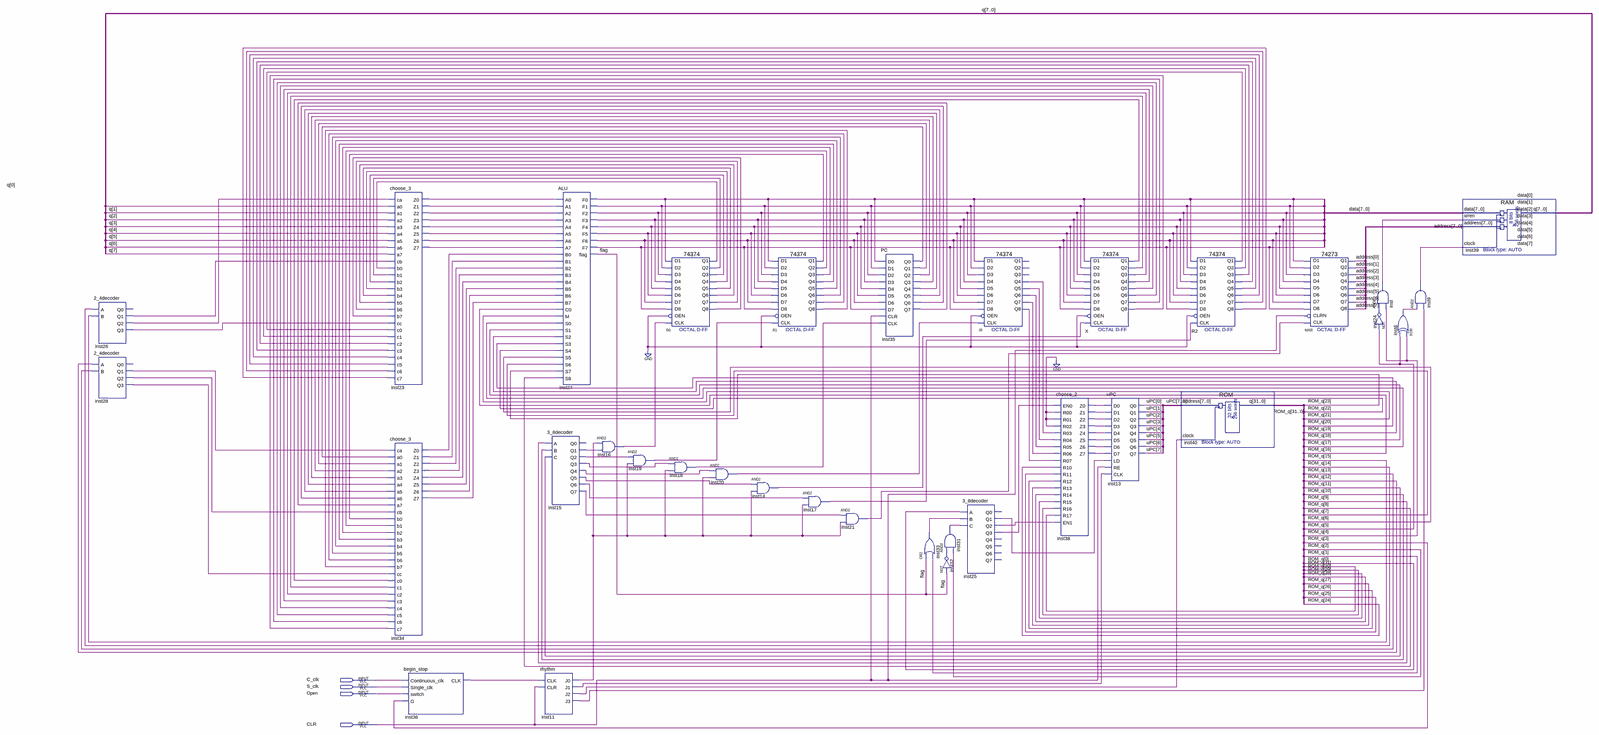
[diagram p0: schematic sheet, whole]
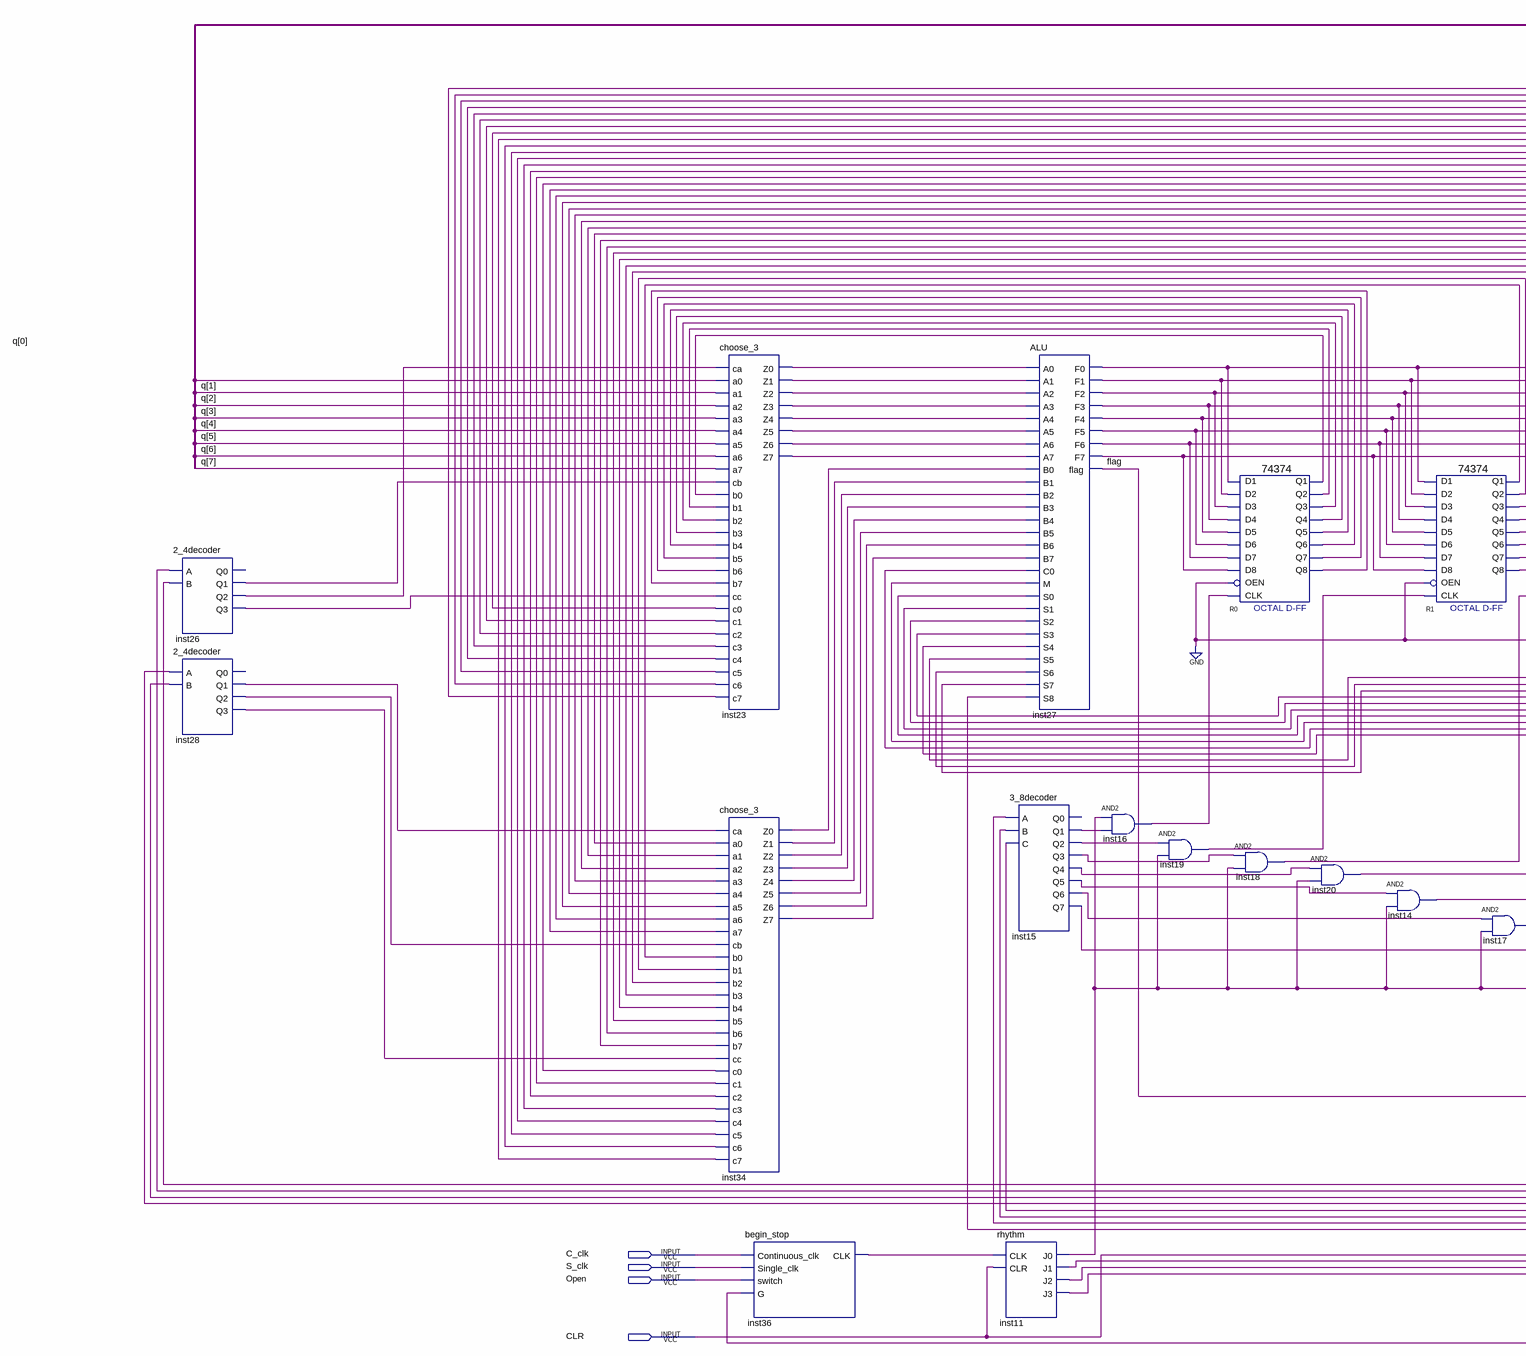
[diagram p1: schematic sheet, left part]
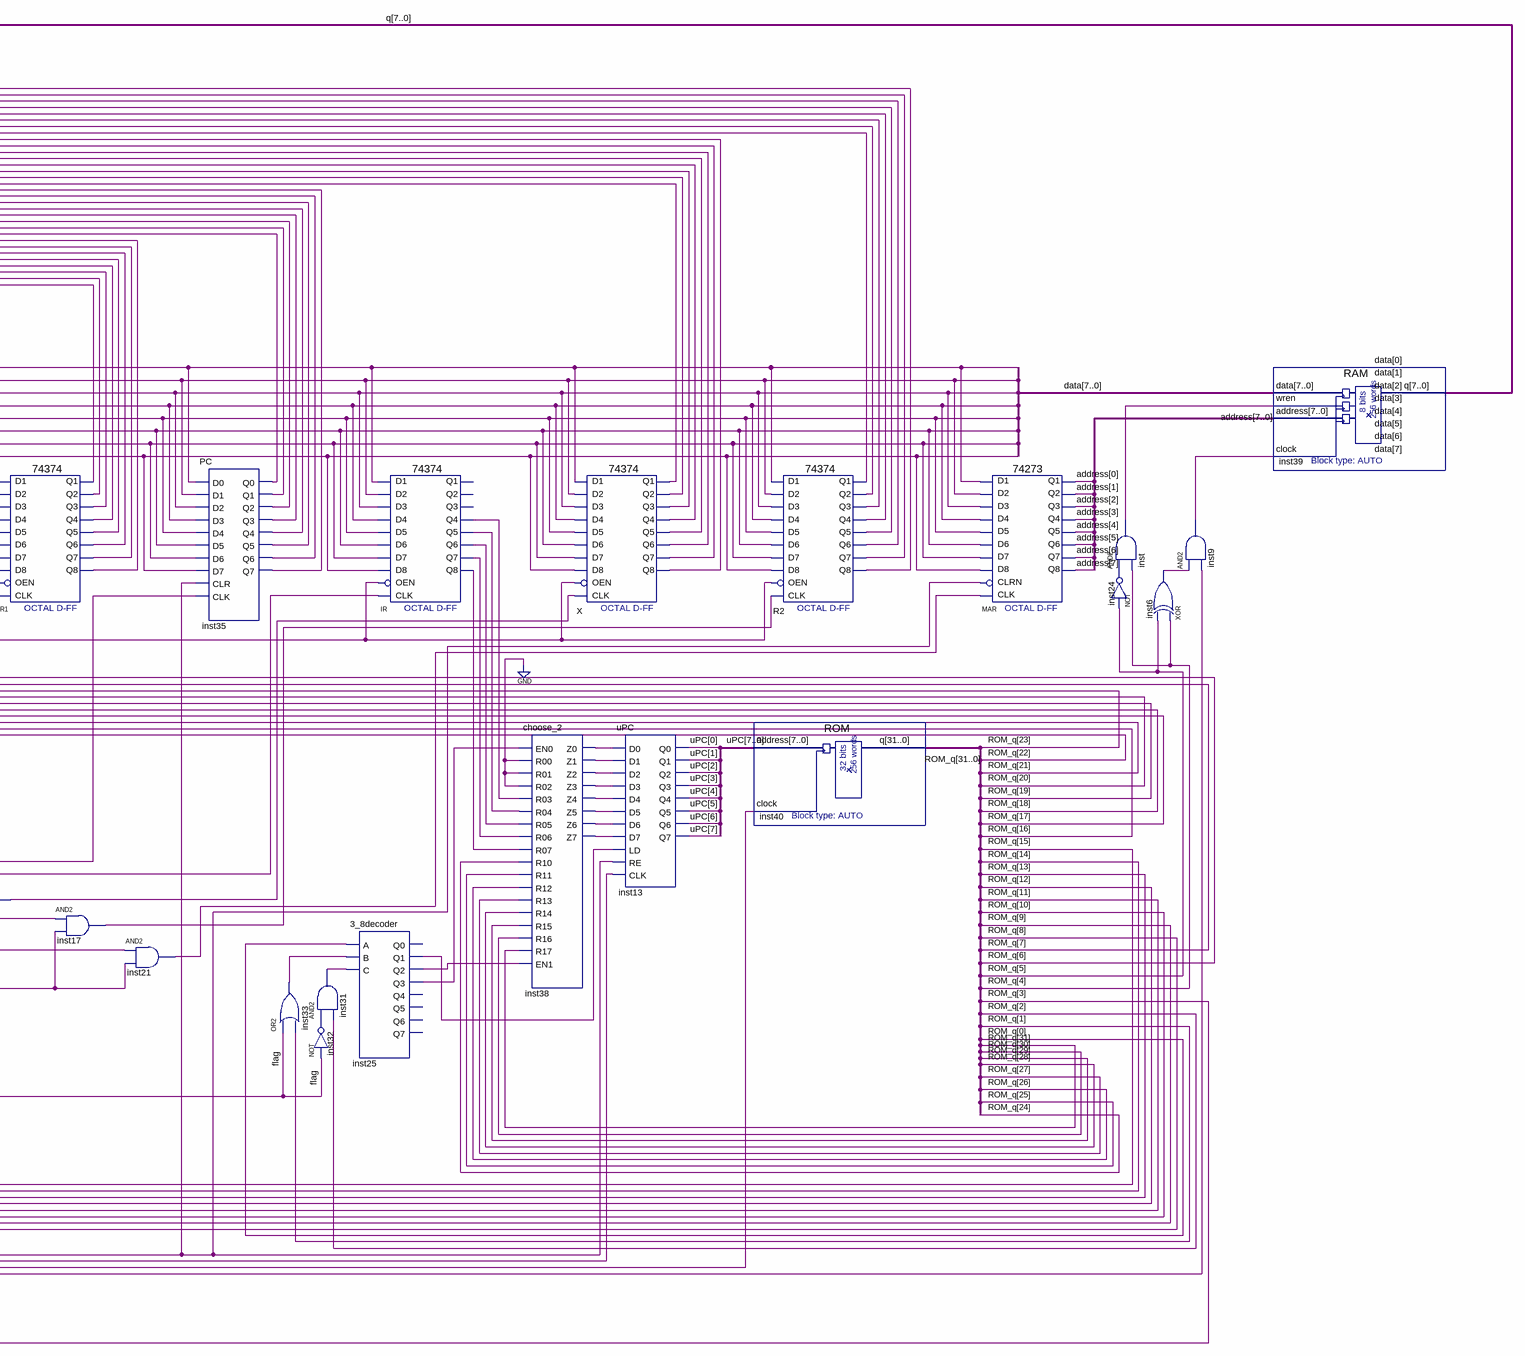
[diagram p2: schematic sheet, right part]
// Quartus schematic ex3.bdf as structural Verilog: 34 symbols, 4 pins
module ex3 (
  input  C_clk,
  input  S_clk,
  input  Open,
  input  CLR
);

  wire flag, inst6_out, inst9_out, inst11_j0, inst11_j1, inst11_j2, inst11_j3, inst14_out, inst15_q1,
       inst15_q2, inst15_q3, inst15_q4, inst15_q5, inst15_q6, inst15_q7, inst16_out, inst17_out, inst18_out,
       inst19_out, inst20_out, inst21_out, inst23_z0, inst23_z1, inst23_z2, inst23_z3, inst23_z4, inst23_z5,
       inst23_z6, inst23_z7, inst24_out, inst25_q1, inst25_q2, inst25_q3, inst26_q1, inst26_q2, inst26_q3,
       inst28_q1, inst28_q2, inst28_q3, inst31_out, inst32_out, inst33_out, inst34_z0, inst34_z1, inst34_z2,
       inst34_z3, inst34_z4, inst34_z5, inst34_z6, inst34_z7, inst35_q0, inst35_q1, inst35_q2, inst35_q3,
       inst35_q4, inst35_q5, inst35_q6, inst35_q7, inst36_clk, inst38_z0, inst38_z1, inst38_z2, inst38_z3,
       inst38_z4, inst38_z5, inst38_z6, inst38_z7, inst_out, IR_q4, IR_q5, IR_q6, IR_q7, IR_q8, R0_q1, R0_q2,
       R0_q3, R0_q4, R0_q5, R0_q6, R0_q7, R0_q8, R1_q1, R1_q2, R1_q3, R1_q4, R1_q5, R1_q6, R1_q7, R1_q8,
       R2_q1, R2_q2, R2_q3, R2_q4, R2_q5, R2_q6, R2_q7, R2_q8, X_q1, X_q2, X_q3, X_q4, X_q5, X_q6, X_q7, X_q8;
  wire [7:0] address, data, q, uPC;
  wire [31:0] ROM_q;

  \2_4decoder  inst26 (.A(ROM_q[14]), .B(ROM_q[15]), .Q1(inst26_q1), .Q2(inst26_q2), .Q3(inst26_q3));  // open: Q0
  \2_4decoder  inst28 (.A(ROM_q[12]), .B(ROM_q[13]), .Q1(inst28_q1), .Q2(inst28_q2), .Q3(inst28_q3));  // open: Q0
  choose_3 inst23 (
    .ca(inst26_q2), .a0(q[0]), .a1(q[1]), .a2(q[2]), .a3(q[3]), .a4(q[4]), .a5(q[5]), .a6(q[6]), .a7(q[7]),
    .cb(inst26_q1), .b0(R0_q1), .b1(R0_q2), .b2(R0_q3), .b3(R0_q4), .b4(R0_q5), .b5(R0_q6), .b6(R0_q7),
    .b7(R0_q8), .cc(inst26_q3), .c0(R2_q1), .c1(R2_q2), .c2(R2_q3), .c3(R2_q4), .c4(R2_q5), .c5(R2_q6),
    .c6(R2_q7), .c7(R2_q8), .Z0(inst23_z0), .Z1(inst23_z1), .Z2(inst23_z2), .Z3(inst23_z3), .Z4(inst23_z4),
    .Z5(inst23_z5), .Z6(inst23_z6), .Z7(inst23_z7));
  choose_3 inst34 (
    .ca(inst28_q1), .a0(inst35_q0), .a1(inst35_q1), .a2(inst35_q2), .a3(inst35_q3), .a4(inst35_q4),
    .a5(inst35_q5), .a6(inst35_q6), .a7(inst35_q7), .cb(inst28_q2), .b0(R1_q1), .b1(R1_q2), .b2(R1_q3),
    .b3(R1_q4), .b4(R1_q5), .b5(R1_q6), .b6(R1_q7), .b7(R1_q8), .cc(inst28_q3), .c0(X_q1), .c1(X_q2),
    .c2(X_q3), .c3(X_q4), .c4(X_q5), .c5(X_q6), .c6(X_q7), .c7(X_q8), .Z0(inst34_z0), .Z1(inst34_z1),
    .Z2(inst34_z2), .Z3(inst34_z3), .Z4(inst34_z4), .Z5(inst34_z5), .Z6(inst34_z6), .Z7(inst34_z7));
  begin_stop inst36 (.Continuous_clk(C_clk), .Single_clk(S_clk), .switch(Open), .G(ROM_q[3]), .CLK(inst36_clk));
  \3_8decoder  inst15 (
    .A(ROM_q[9]), .B(ROM_q[10]), .C(ROM_q[11]), .Q1(inst15_q1), .Q2(inst15_q2), .Q3(inst15_q3),
    .Q4(inst15_q4), .Q5(inst15_q5), .Q6(inst15_q6), .Q7(inst15_q7));  // open: Q0
  rhythm inst11 (.CLK(inst36_clk), .CLR(CLR), .J0(inst11_j0), .J1(inst11_j1), .J2(inst11_j2), .J3(inst11_j3));
  ALU inst27 (
    .A0(inst23_z0), .A1(inst23_z1), .A2(inst23_z2), .A3(inst23_z3), .A4(inst23_z4), .A5(inst23_z5),
    .A6(inst23_z6), .A7(inst23_z7), .B0(inst34_z0), .B1(inst34_z1), .B2(inst34_z2), .B3(inst34_z3),
    .B4(inst34_z4), .B5(inst34_z5), .B6(inst34_z6), .B7(inst34_z7), .C0(ROM_q[16]), .M(ROM_q[21]),
    .S0(ROM_q[17]), .S1(ROM_q[18]), .S2(ROM_q[19]), .S3(ROM_q[20]), .S4(ROM_q[22]), .S5(ROM_q[6]),
    .S6(ROM_q[7]), .S7(ROM_q[23]), .S8(ROM_q[8]), .F0(data[0]), .F1(data[1]), .F2(data[2]), .F3(data[3]),
    .F4(data[4]), .F5(data[5]), .F6(data[6]), .F7(data[7]), .flag(flag));
  and inst16 (inst16_out, inst11_j0, inst15_q1);
  and inst19 (inst19_out, inst15_q2, inst11_j0);
  \74374  R0 (
    .D1(data[0]), .D2(data[1]), .D3(data[2]), .D4(data[3]), .D6(data[5]), .D5(data[4]), .OEN(1'b0),
    .D8(data[7]), .D7(data[6]), .CLK(inst16_out), .Q2(R0_q2), .Q3(R0_q3), .Q5(R0_q5), .Q4(R0_q4), .Q6(R0_q6),
    .Q7(R0_q7), .Q8(R0_q8), .Q1(R0_q1));
  and inst18 (inst18_out, inst15_q3, inst11_j0);
  and inst20 (inst20_out, inst15_q4, inst11_j0);
  \74374  R1 (
    .D1(data[0]), .D2(data[1]), .D3(data[2]), .D4(data[3]), .D6(data[5]), .D5(data[4]), .OEN(1'b0),
    .D8(data[7]), .D7(data[6]), .CLK(inst19_out), .Q2(R1_q2), .Q3(R1_q3), .Q5(R1_q5), .Q4(R1_q4), .Q6(R1_q6),
    .Q7(R1_q7), .Q8(R1_q8), .Q1(R1_q1));
  and inst14 (inst14_out, inst15_q5, inst11_j0);
  and inst17 (inst17_out, inst15_q6, inst11_j0);
  and inst21 (inst21_out, inst15_q7, inst11_j0);
  PC inst35 (
    .D0(data[0]), .D1(data[1]), .D2(data[2]), .D3(data[3]), .D4(data[4]), .D5(data[5]), .D6(data[6]),
    .D7(data[7]), .CLR(CLR), .CLK(inst18_out), .Q0(inst35_q0), .Q1(inst35_q1), .Q2(inst35_q2),
    .Q3(inst35_q3), .Q4(inst35_q4), .Q5(inst35_q5), .Q6(inst35_q6), .Q7(inst35_q7));
  and inst31 (inst31_out, inst32_out, ROM_q[2]);
  or inst33 (inst33_out, flag, ROM_q[1]);
  not inst32 (inst32_out, flag);
  \3_8decoder  inst25 (
    .A(ROM_q[0]), .B(inst33_out), .C(inst31_out), .Q1(inst25_q1), .Q2(inst25_q2), .Q3(inst25_q3));  // open: Q0, Q4, Q5, Q6, Q7
  \74374  IR (
    .D1(data[0]), .D2(data[1]), .D3(data[2]), .D4(data[3]), .D6(data[5]), .D5(data[4]), .OEN(1'b0),
    .D8(data[7]), .D7(data[6]), .CLK(inst20_out), .Q5(IR_q5), .Q4(IR_q4), .Q6(IR_q6), .Q7(IR_q7), .Q8(IR_q8));  // open: Q2, Q3, Q1
  choose_2 inst38 (
    .EN0(inst25_q3), .R00(1'b0), .R01(1'b0), .R02(1'b0), .R03(IR_q4), .R04(IR_q5), .R05(IR_q6), .R06(IR_q7),
    .R07(IR_q8), .R10(ROM_q[24]), .R11(ROM_q[25]), .R12(ROM_q[26]), .R13(ROM_q[27]), .R14(ROM_q[28]),
    .R15(ROM_q[29]), .R16(ROM_q[30]), .R17(ROM_q[31]), .EN1(inst25_q2), .Z0(inst38_z0), .Z1(inst38_z1),
    .Z2(inst38_z2), .Z3(inst38_z3), .Z4(inst38_z4), .Z5(inst38_z5), .Z6(inst38_z6), .Z7(inst38_z7));
  \74374  X (
    .D1(data[0]), .D2(data[1]), .D3(data[2]), .D4(data[3]), .D6(data[5]), .D5(data[4]), .OEN(1'b0),
    .D8(data[7]), .D7(data[6]), .CLK(inst14_out), .Q2(X_q2), .Q3(X_q3), .Q5(X_q5), .Q4(X_q4), .Q6(X_q6),
    .Q7(X_q7), .Q8(X_q8), .Q1(X_q1));
  uPC inst13 (
    .D0(inst38_z0), .D1(inst38_z1), .D2(inst38_z2), .D3(inst38_z3), .D4(inst38_z4), .D5(inst38_z5),
    .D6(inst38_z6), .D7(inst38_z7), .LD(inst25_q1), .RE(CLR), .CLK(inst11_j1), .Q0(uPC[0]), .Q1(uPC[1]),
    .Q2(uPC[2]), .Q3(uPC[3]), .Q4(uPC[4]), .Q5(uPC[5]), .Q6(uPC[6]), .Q7(uPC[7]));
  ROM inst40 (.address(uPC), .clock(inst11_j2), .q(ROM_q));
  \74374  R2 (
    .D1(data[0]), .D2(data[1]), .D3(data[2]), .D4(data[3]), .D6(data[5]), .D5(data[4]), .OEN(1'b0),
    .D8(data[7]), .D7(data[6]), .CLK(inst17_out), .Q2(R2_q2), .Q3(R2_q3), .Q5(R2_q5), .Q4(R2_q4), .Q6(R2_q6),
    .Q7(R2_q7), .Q8(R2_q8), .Q1(R2_q1));
  \74273  MAR (
    .D2(data[1]), .D3(data[2]), .D1(data[0]), .D4(data[3]), .D7(data[6]), .D6(data[5]), .D5(data[4]),
    .D8(data[7]), .CLK(inst21_out), .CLRN(CLR), .Q4(address[3]), .Q1(address[0]), .Q2(address[1]),
    .Q3(address[2]), .Q6(address[5]), .Q5(address[4]), .Q7(address[6]), .Q8(address[7]));
  and inst (inst_out, inst24_out, ROM_q[4]);
  not inst24 (inst24_out, ROM_q[5]);
  xor inst6 (inst6_out, ROM_q[4], ROM_q[5]);
  and inst9 (inst9_out, inst6_out, inst11_j3);
  RAM inst39 (.data(data), .wren(inst_out), .address(address), .clock(inst9_out), .q(q));
endmodule
